# Altium schematic sheet Booster_Channel_RF_HL.SchDoc: Booster
size 420 x 297 mm; Comments: Preamplifier circuit design for RFPA; Wersja: 1.4; CopyrightBy: Maciej Urbanski; CopyrightDate: 2018; TopSheet: RFPA_PREAMP; CurrentSheet: RFPA_PREAMP; Author: G.Kasprowicz; CompanyName: WUT ISE; DrawnBy: G.Kasprowicz; Organization: WUT ISE; Address1: PW ISE; Address2: Nowowiejska 15/19 00-665 Warsaw; Address3: gkasprow@gmail.com; SheetNumber: -; SheetTotal: -; ModifiedBy: -; CheckedDate: -; Title2: RF Channel; DivGrp: WUT ISE; Designer: Maciej Urbański; ModifiedDate: -; ProjectName: Sensor Box
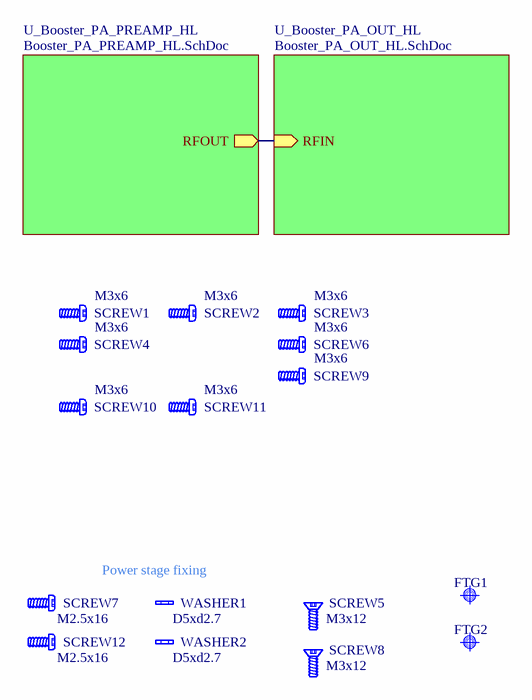
[diagram p0: Booster_Channel_RF_HL.SchDoc]

## Parts
FTG1  Use only in PCB  [FIDUCIAL_TOP_C100-200]  (value not drawn)  (no BOM)
FTG2  Use only in PCB  [FIDUCIAL_TOP_S100-200]  (value not drawn)  (no BOM)
SCREW1  M3x6  [BOSSARD_BN5687-3061605_v]
SCREW2  M3x6  [BOSSARD_BN5687-3061605_v]
SCREW3  M3x6  [BOSSARD_BN5687-3061605_v]
SCREW4  M3x6  [BOSSARD_BN5687-3061605_v]
SCREW5  M3x12  [BOSSARD_B3X12/BN4851_v]
SCREW6  M3x6  [BOSSARD_BN5687-3061605_v]
SCREW7  M2.5x16  [BOSSARD_BN5687-3061603_v]
SCREW8  M3x12  [BOSSARD_B3X12/BN4851_v]
SCREW9  M3x6  [BOSSARD_BN5687-3061605_v]
SCREW10  M3x6  [BOSSARD_BN5687-3061605_v]
SCREW11  M3x6  [BOSSARD_BN5687-3061605_v]
SCREW12  M2.5x16  [BOSSARD_BN5687-3061603_v]
WASHER1  D5xd2.7  [BOSSARD_BN678-8303525_v]
WASHER2  D5xd2.7  [BOSSARD_BN678-8303525_v]

## Sub-sheets
U_Booster_PA_OUT_HL = Booster_PA_OUT_HL.SchDoc: RFIN (in)
U_Booster_PA_PREAMP_HL = Booster_PA_PREAMP_HL.SchDoc: RFOUT (out)

## Nets
(unnamed): sheet U_Booster_PA_OUT_HL/RFIN, sheet U_Booster_PA_PREAMP_HL/RFOUT

## Notes on the sheet
- (near WASHER1) Power stage fixing
- Project/Equipment
- Document
- Designer
- Drawn by
- Check.by
- Copyright WUT ISE 2019.
  This documentation describes Open Hardware and is licensed under the CERN OHL v.1.1. You may redistribute and modify this documentation under the terms of the CERN OHL v.1.1. (http://ohwr.org/CERNOHL). This documentation is distributed WITHOUT ANY EXPRESS OR IMPLIED WARRANTY, INCLUDING OF MERCHANTABILITY, SATISFACTORY QUALITY AND FITNESS FOR A PARTICULAR PURPOSE. Please see the CERN OHL v.1.1 for applicable conditions.
- Contact
- File
- Last Mod.
- Print Date
- Sheet
- Size
- A3
- of
- Rev

## Library data of the parts
FTG1 = FIDUCIAL_TARGET_C100-200: Fiducial Target; Part Description: Round Fiducial Target, Top Layer, 1.0mm, Top Solder 2.0mm, Keepout =2.0mm; Mounted: No; Part Number: FIDUCIAL_TARGET_C100-200; Component Type: Standard (No BOM); Pin Count: 1; Family: Fiducial; Socket: No; SMD: Yes; Sense: No; Status: None; ComponentHeight: 0mm; HelpURL: Undefined; Author: CERN DEM JLC; CreateDate: 09.02.2010; LatestRevisionDate: 04.04.2012; PackageDescription: Round Fiducial Target, Top Layer, 1.0mm, Top Solder 2.0mm, Keepout =2.0mm
FTG2 = FIDUCIAL_TARGET_S100-200: Fiducial Target; Part Description: Square Fiducial Target, Top Layer, 1.0mm, Top Solder 2.0mm, Keepout =2.0mm; Mounted: No; Part Number: FIDUCIAL_TARGET_S100-200; Component Type: Standard (No BOM); Pin Count: 1; Family: Fiducial; Socket: No; SMD: Yes; Sense: No; Status: None; ComponentHeight: 0mm; HelpURL: Undefined; Author: CERN DEM JLC; CreateDate: 09.02.2010; LatestRevisionDate: 04.04.2012; PackageDescription: Square Fiducial Target, Top Layer, 1.0mm, Top Solder 2.0mm, Keepout =2.0mm
SCREW1-SCREW4 SCREW6 SCREW9-SCREW11 = BOSSARD_BN5687-3061605_v: Screw; Part Description: M3 L=6mm Hexalobular Socket Pan Head Screw, Fully Threaded, Stainless Steel A2; Manufacturer Part Number: BN5687 Art.3061605; PressFit: No; Part Number: BOSSARD_BN5687-3061605_v; Component Kind: Standard; Component Type: Mechanical; Pin Count: 0; PackageDescription: M3 L=6mm Hexalobular Socket Pan Head Screw, Fully Threaded - Stainless Steel A2; Mounted: Yes; Socket: No; SMD: No; Sense: No; Status: None; Value: M3x6; Manufacturer: BOSSARD; ComponentHeight: 2.4mm; HelpURL: \\cern.ch\dfs\Applications\Altium\Datasheets\BOSSARD_BN5687-3061605.pdf; Author: CERN DEM JLC; CreateDate: 15/01/2013; LatestRevisionDate: 15/01/2013
SCREW5 SCREW8 = Screw_M3x12_Countersunk_v: M3 L=12mm Hexalobular Countersunk Head Screw, Fully Threaded, Stainless Steel A2; Part Number: BOSSARD_B3X12/BN4851; Manufacturer: BOSSARD; Manufacturer Part Number: B3X12/BN4851 Art.1148508; PressFit: No; Component Kind: Standard; Component Type: Mechanical; Footprint: BOSSARD_B3X12/BN4851; Pin Count: 0; PackageDescription: M3 L=12mm Hexalobular Countersunk Head Screw, Fully Threaded, Stainless Steel A2; Mounted: Yes; Socket: No; SMD: No; Sense: No; Status: None; Value: M3x12; Part Description: M3 L=12mm Hexalobular Countersunk Head Screw, Fully Threaded, Stainless Steel A2; ComponentHeight: 14.4mm; HelpURL: \\cern.ch\dfs\Applications\Altium\Datasheets\BOSSARD_BN5687-3061609.pdf; Author: GK; CreateDate: 22.08.2013; LatestRevisionDate: 22.08.2013
SCREW7 SCREW12 = BOSSARD_BN5687-3061603_v: Screw; Part Description: M2.5 L=16mm Hexalobular Socket Pan Head Screw, Fully Threaded, Stainless Steel A2; Manufacturer Part Number: BN5687 Art.3061603; PressFit: No; Part Number: BOSSARD_BN5687-3061603_v; Component Kind: Standard; Component Type: Mechanical; Pin Count: 0; PackageDescription: M2.5 L=16mm Hexalobular Socket Pan Head Screw, Fully Threaded - Stainless Steel A2; Mounted: Yes; Socket: No; SMD: No; Sense: No; Status: None; Value: M2.5x16; Manufacturer: BOSSARD; ComponentHeight: 18.1mm; HelpURL: \\cern.ch\dfs\Applications\Altium\Datasheets\BOSSARD_BN5687-3061603.pdf; Author: CERN DEM JLC; CreateDate: 17.04.2014; LatestRevisionDate: 17.04.2014
WASHER1 WASHER2 = BOSSARD_BN678-8303525_v: Washer; Part Description: Waved Spring Washer for M2.5 Screw, Stainless Steel A2 / 1.4310; Manufacturer Part Number: BN678 Art.8303525; PressFit: No; Status Comment: Replaced by BOSSARD_BN83728-8051127_v; Part Number: BOSSARD_BN678-8303525_v; Component Kind: Standard; Component Type: Mechanical; Pin Count: 0; PackageDescription: Waved Spring Washer for M2.5 Screw, Stainless Steel A2 / 1.4310; Mounted: Yes; Socket: No; SMD: No; Sense: No; Status: Obsolete; Value: D5xd2.7; Manufacturer: BOSSARD; ComponentHeight: 0.3mm; HelpURL: \\cern.ch\dfs\Applications\Altium\Datasheets\BOSSARD_BN678-8303525.pdf; Author: CERN DEM JLC; CreateDate: 22.10.2012; LatestRevisionDate: 15.01.2013